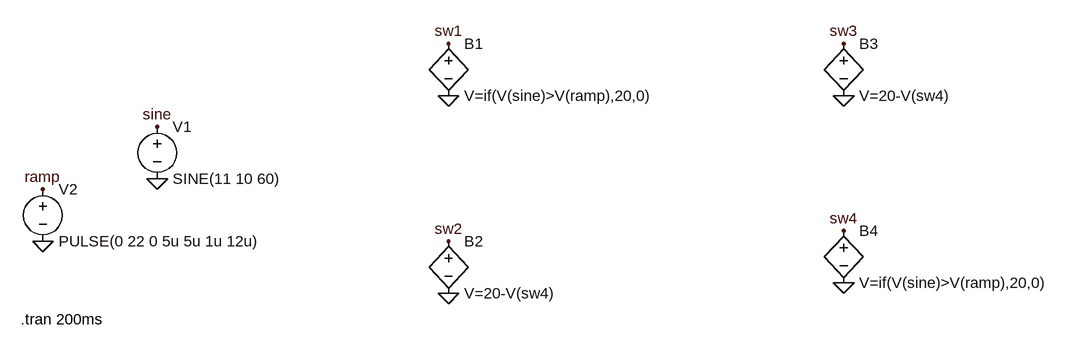
[diagram p0: schematic Draft4.asc]
Draft4.asc, the LTspice schematic file:
Version 4
SHEET 1 1552 680
FLAG -32 208 0
FLAG 144 112 0
FLAG 592 288 0
FLAG 1200 272 0
FLAG 592 -16 0
FLAG 1200 -16 0
FLAG 144 32 sine
FLAG -32 128 ramp
FLAG 592 -96 sw1
FLAG 592 208 sw2
FLAG 1200 -96 sw3
FLAG 1200 192 sw4
SYMBOL voltage 144 16 R0
WINDOW 123 0 0 Left 0
WINDOW 39 0 0 Left 0
SYMATTR InstName V1
SYMATTR Value SINE(11 10 60)
SYMBOL voltage -32 112 R0
WINDOW 123 0 0 Left 0
WINDOW 39 0 0 Left 0
SYMATTR InstName V2
SYMATTR Value PULSE(0 22 0 5u 5u 1u 12u)
SYMBOL bv 592 -112 R0
SYMATTR InstName B1
SYMATTR Value V=if(V(sine)>V(ramp),20,0)
SYMBOL bv 592 192 R0
SYMATTR InstName B2
SYMATTR Value V=20-V(sw4)
SYMBOL bv 1200 -112 R0
SYMATTR InstName B3
SYMATTR Value V=20-V(sw4)
SYMBOL bv 1200 176 R0
SYMATTR InstName B4
SYMATTR Value V=if(V(sine)>V(ramp),20,0)
TEXT -66 328 Left 2 !.tran 200ms

The netlist it stands for:
* Draft4.asc
V1 sine 0 SINE(11 10 60)
V2 ramp 0 PULSE(0 22 0 5u 5u 1u 12u)
B1 sw1 0 V=if(V(sine)>V(ramp),20,0)
B2 sw2 0 V=20-V(sw4)
B3 sw3 0 V=20-V(sw4)
B4 sw4 0 V=if(V(sine)>V(ramp),20,0)
.tran 200ms
.backanno
.end